# EAGLE schematic Strampler_redesign_v2_2 (EAGLE 7.3.0)
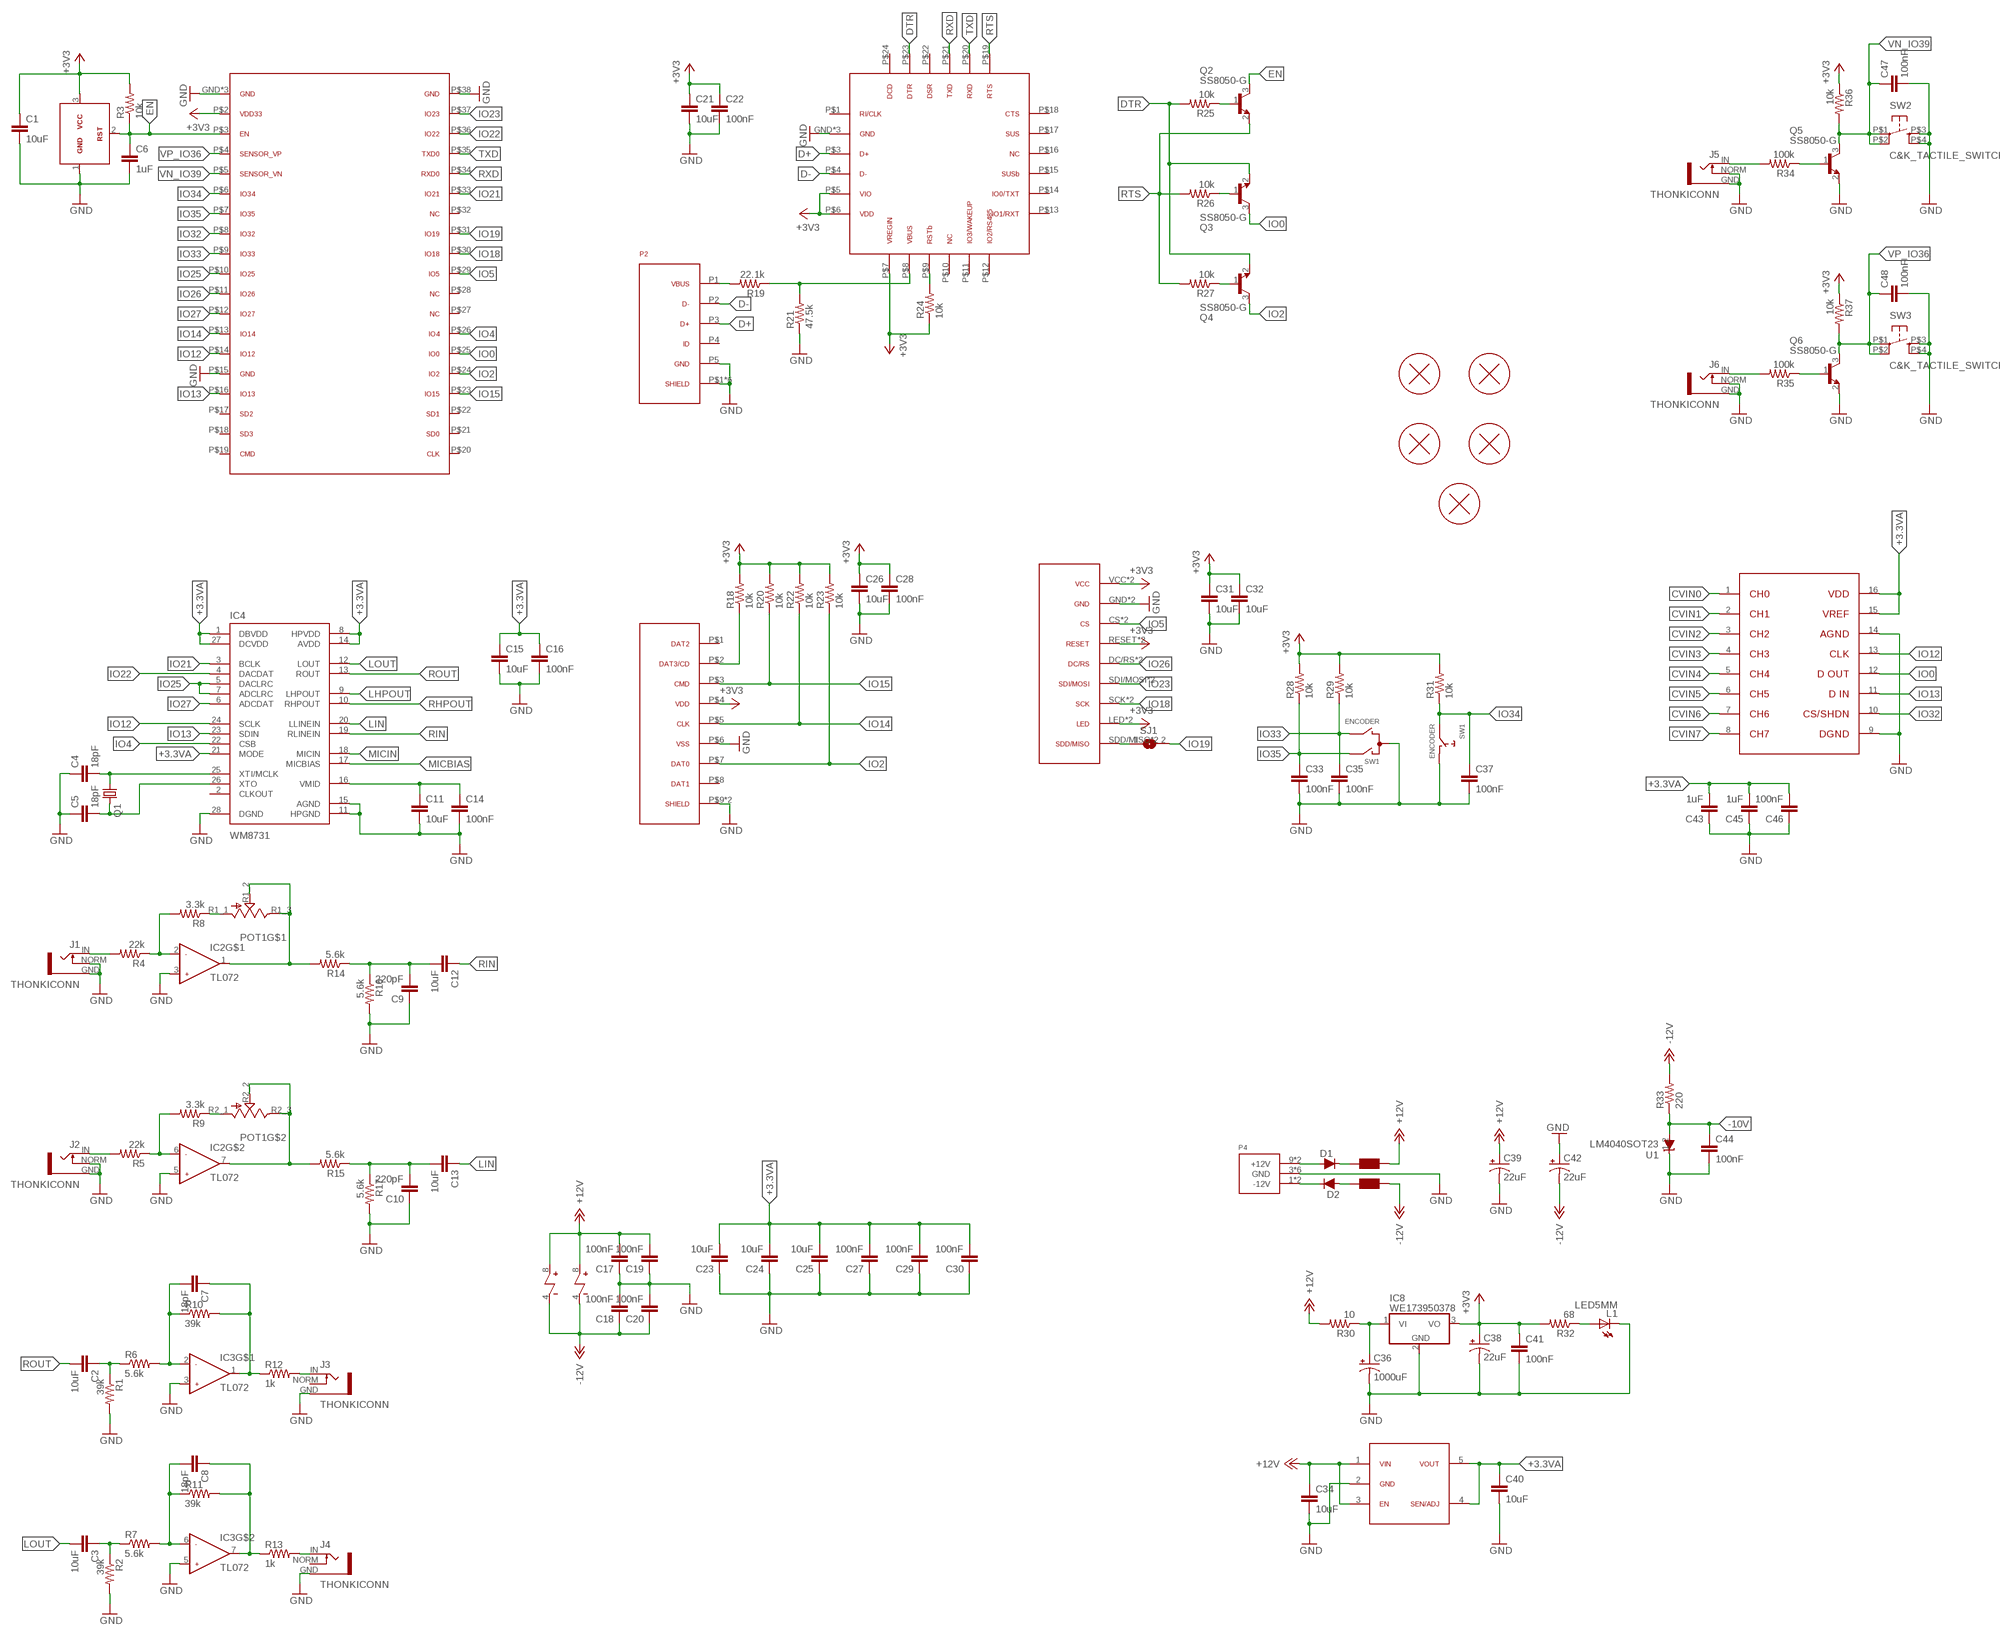
[diagram p0: schematic, sheet 1, part 1 of 2]
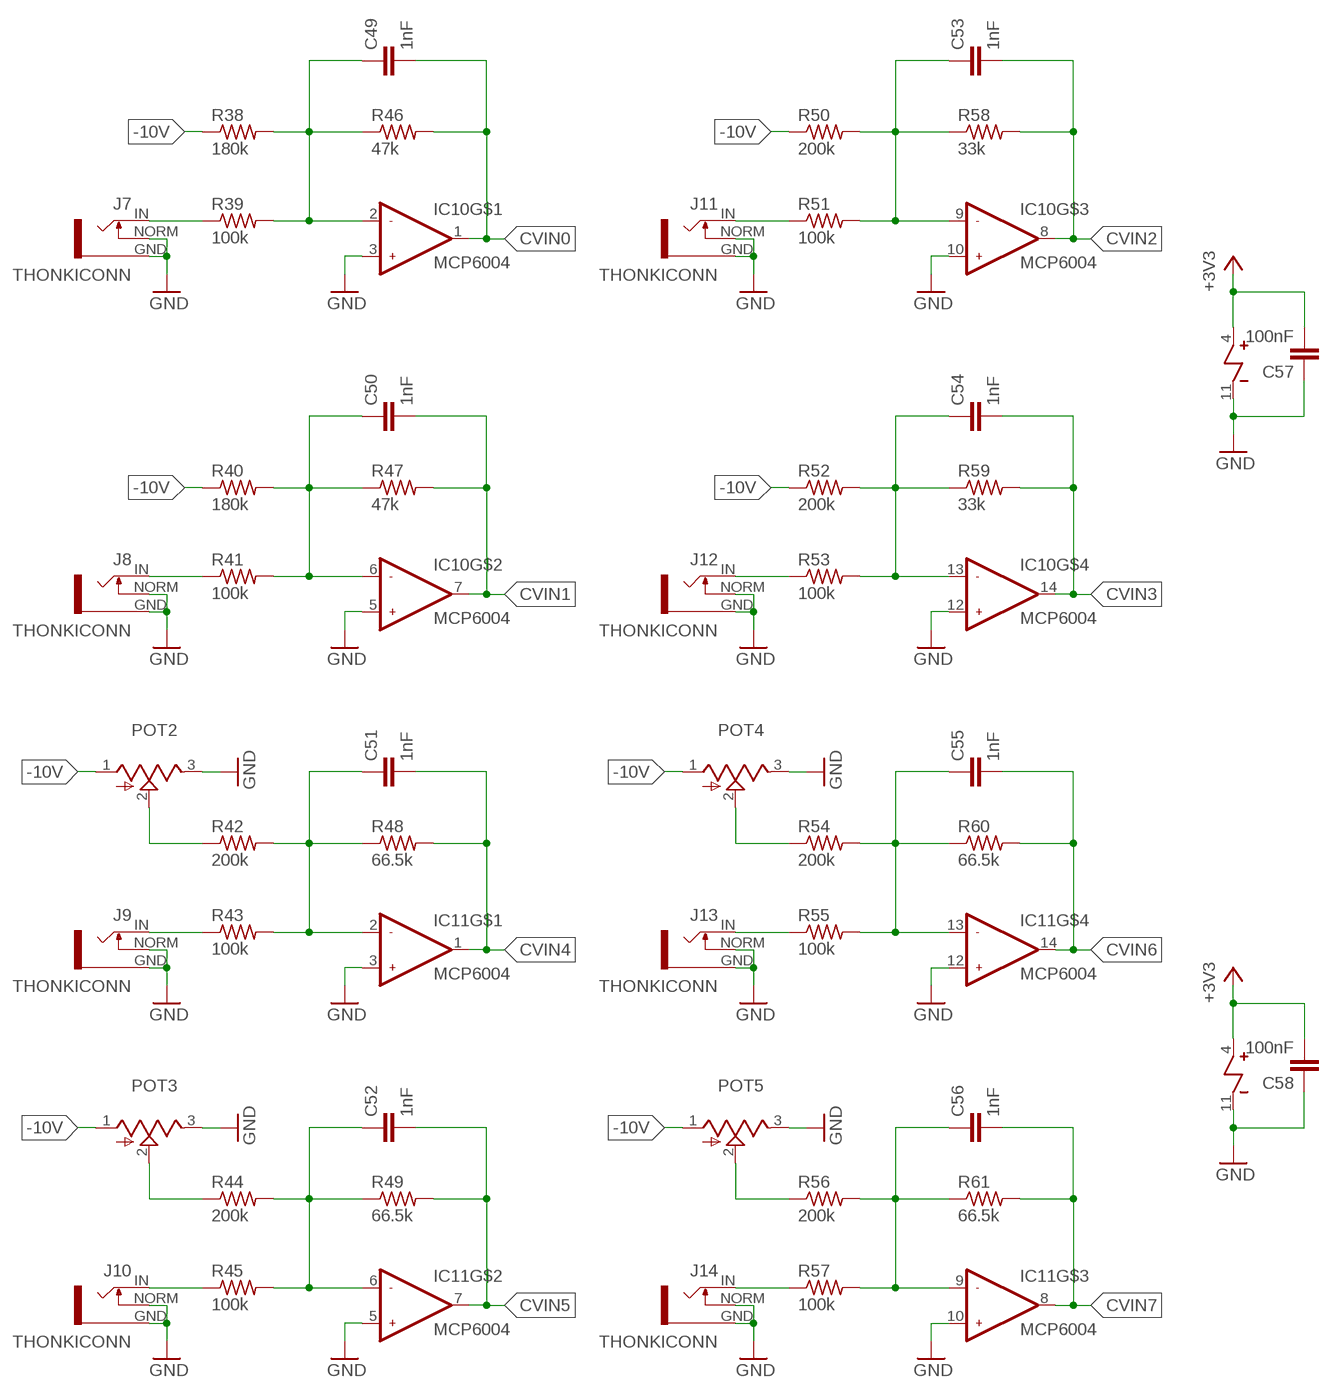
[diagram p1: schematic, sheet 1, part 2 of 2]

## Parts
C1  10uF  CAPACITOR0805  [R0805]
C2  10uF  CAPACITOR0805  [R0805]
C3  10uF  CAPACITOR0805  [R0805]
C4  18pF  CAPACITOR  [RESISTOR_0603]
C5  18pF  CAPACITOR  [RESISTOR_0603]
C6  1uF  CAPACITOR  [RESISTOR_0603]
C7  18pF  CAPACITOR  [RESISTOR_0603]
C8  18pF  CAPACITOR  [RESISTOR_0603]
C9  220pF  CAPACITOR  [RESISTOR_0603]
C10  220pF  CAPACITOR  [RESISTOR_0603]
C11  10uF  CAPACITOR0805  [R0805]
C12  10uF  CAPACITOR0805  [R0805]
C13  10uF  CAPACITOR0805  [R0805]
C14  100nF  CAPACITOR  [RESISTOR_0603]
C15  10uF  CAPACITOR0805  [R0805]
C16  100nF  CAPACITOR  [RESISTOR_0603]
C17  100nF  CAPACITOR  [RESISTOR_0603]
C18  100nF  CAPACITOR  [RESISTOR_0603]
C19  100nF  CAPACITOR  [RESISTOR_0603]
C20  100nF  CAPACITOR  [RESISTOR_0603]
C21  10uF  CAPACITOR0805  [R0805]
C22  100nF  CAPACITOR  [RESISTOR_0603]
C23  10uF  CAPACITOR0805  [R0805]
C24  10uF  CAPACITOR0805  [R0805]
C25  10uF  CAPACITOR0805  [R0805]
C26  10uF  CAPACITOR0805  [R0805]
C27  100nF  CAPACITOR  [RESISTOR_0603]
C28  100nF  CAPACITOR  [RESISTOR_0603]
C29  100nF  CAPACITOR  [RESISTOR_0603]
C30  100nF  CAPACITOR  [RESISTOR_0603]
C31  10uF  CAPACITOR0805  [R0805]
C32  10uF  CAPACITOR0805  [R0805]
C33  100nF  CAPACITOR  [RESISTOR_0603]
C34  10uF  CAPACITOR1210  [R1210]
C35  100nF  CAPACITOR  [RESISTOR_0603]
C36  1000uF  CAP_POLG  [PANASONIC_G]
C37  100nF  CAPACITOR  [RESISTOR_0603]
C38  22uF  CAP_POL1206_TANT  [1206_POL]
C39  22uF  CAP_POL1206_TANT  [1206_POL]
C40  10uF  CAPACITOR0805  [R0805]
C41  100nF  CAPACITOR  [RESISTOR_0603]
C42  22uF  CAP_POL1206_TANT  [1206_POL]
C43  1uF  CAPACITOR  [RESISTOR_0603]
C44  100nF  CAPACITOR  [RESISTOR_0603]
C45  1uF  CAPACITOR  [RESISTOR_0603]
C46  100nF  CAPACITOR  [RESISTOR_0603]
C47  100nF  CAPACITOR  [RESISTOR_0603]
C48  100nF  CAPACITOR  [RESISTOR_0603]
C49  1nF  CAPACITOR  [RESISTOR_0603]
C50  1nF  CAPACITOR  [RESISTOR_0603]
C51  1nF  CAPACITOR  [RESISTOR_0603]
C52  1nF  CAPACITOR  [RESISTOR_0603]
C53  1nF  CAPACITOR  [RESISTOR_0603]
C54  1nF  CAPACITOR  [RESISTOR_0603]
C55  1nF  CAPACITOR  [RESISTOR_0603]
C56  1nF  CAPACITOR  [RESISTOR_0603]
C57  100nF  CAPACITOR  [RESISTOR_0603]
C58  100nF  CAPACITOR  [RESISTOR_0603]
D1  DIODE  [SOD123]
D2  DIODE  [SOD123]
F1  FERRITE-BEAD0805  [R0805]
F2  FERRITE-BEAD0805  [R0805]
H1  PCB_SCREW  [PCB_SCREW]
H2  PCB_SCREW  [PCB_SCREW]
H3  PCB_SCREW  [PCB_SCREW]
H4  PCB_SCREW  [PCB_SCREW]
H5  PCB_SCREW  [PCB_SCREW]
IC1  MIC803  [SOT23]
IC2  TL072  OPAMP_DUAL  [SOIC8]
IC3  TL072  OPAMP_DUAL  [SOIC8]
IC4  WM8731  [SSOP28]
IC5  ESP32-WROVER-B  [ESP32-WROVER-B]
IC6  CP2102N  [CP2102N]
IC7  ADP7118  [SOT23-5L]
IC8  WE173950378  [WE78]
IC9  MCP3208  [SOIC16]
IC10  MCP6004  OPAMP_QUADPWR  [TSSOP14]
IC11  MCP6004  OPAMP_QUADPWR  [TSSOP14]
J1  THONKICONN  [PROTOJACK]
J2  THONKICONN  [PROTOJACK]
J3  THONKICONN  [PROTOJACK]
J4  THONKICONN  [PROTOJACK]
J5  THONKICONN  [PROTOJACK]
J6  THONKICONN  [PROTOJACK]
J7  THONKICONN  [PROTOJACK]
J8  THONKICONN  [PROTOJACK]
J9  THONKICONN  [PROTOJACK]
J10  THONKICONN  [PROTOJACK]
J11  THONKICONN  [PROTOJACK]
J12  THONKICONN  [PROTOJACK]
J13  THONKICONN  [PROTOJACK]
J14  THONKICONN  [PROTOJACK]
L1  LED5MM  [LED_5MM]
P1  SD-CARD  [SD-CARD-THONK]
P2  USB-B  [USB-B-MOLEX-1050170001]
P3  MSP2202_DISPLAY  [MSP2202_DISPLAY]
P4  POWER_SIMPLE10  [POWER_10]
POT1  POT_DUAL_THONK  [POT_DUAL_THONK]
POT2  POT_VERTICAL  [ALPS_POT_VERTICAL]
POT3  POT_VERTICAL  [ALPS_POT_VERTICAL]
POT4  POT_VERTICAL  [ALPS_POT_VERTICAL]
POT5  POT_VERTICAL  [ALPS_POT_VERTICAL]
Q1  CRYSTAL  [HC49UP]
Q2  SS8050-G  MMBT3904SOT23  [SOT23]
Q3  SS8050-G  MMBT3904SOT23  [SOT23]
Q4  SS8050-G  MMBT3904SOT23  [SOT23]
Q5  SS8050-G  MMBT3904SOT23  [SOT23]
Q6  SS8050-G  MMBT3904SOT23  [SOT23]
R1  39k  RESISTOR  [RESISTOR_0603]
R2  39k  RESISTOR  [RESISTOR_0603]
R3  10k  RESISTOR  [RESISTOR_0603]
R4  22k  RESISTOR  [RESISTOR_0603]
R5  22k  RESISTOR  [RESISTOR_0603]
R6  5.6k  RESISTOR  [RESISTOR_0603]
R7  5.6k  RESISTOR  [RESISTOR_0603]
R8  3.3k  RESISTOR  [RESISTOR_0603]
R9  3.3k  RESISTOR  [RESISTOR_0603]
R10  39k  RESISTOR  [RESISTOR_0603]
R11  39k  RESISTOR  [RESISTOR_0603]
R12  1k  RESISTOR  [RESISTOR_0603]
R13  1k  RESISTOR  [RESISTOR_0603]
R14  5.6k  RESISTOR  [RESISTOR_0603]
R15  5.6k  RESISTOR  [RESISTOR_0603]
R16  5.6k  RESISTOR  [RESISTOR_0603]
R17  5.6k  RESISTOR  [RESISTOR_0603]
R18  10k  RESISTOR  [RESISTOR_0603]
R19  22.1k  RESISTOR  [RESISTOR_0603]
R20  10k  RESISTOR  [RESISTOR_0603]
R21  47.5k  RESISTOR  [RESISTOR_0603]
R22  10k  RESISTOR  [RESISTOR_0603]
R23  10k  RESISTOR  [RESISTOR_0603]
R24  10k  RESISTOR  [RESISTOR_0603]
R25  10k  RESISTOR  [RESISTOR_0603]
R26  10k  RESISTOR  [RESISTOR_0603]
R27  10k  RESISTOR  [RESISTOR_0603]
R28  10k  RESISTOR  [RESISTOR_0603]
R29  10k  RESISTOR  [RESISTOR_0603]
R30  10  RESISTOR2512  [R2512]
R31  10k  RESISTOR  [RESISTOR_0603]
R32  68  RESISTOR  [RESISTOR_0603]
R33  220  RESISTOR  [RESISTOR_0603]
R34  100k  RESISTOR  [RESISTOR_0603]
R35  100k  RESISTOR  [RESISTOR_0603]
R36  10k  RESISTOR  [RESISTOR_0603]
R37  10k  RESISTOR  [RESISTOR_0603]
R38  180k  RESISTOR  [RESISTOR_0603]
R39  100k  RESISTOR  [RESISTOR_0603]
R40  180k  RESISTOR  [RESISTOR_0603]
R41  100k  RESISTOR  [RESISTOR_0603]
R42  200k  RESISTOR  [RESISTOR_0603]
R43  100k  RESISTOR  [RESISTOR_0603]
R44  200k  RESISTOR  [RESISTOR_0603]
R45  100k  RESISTOR  [RESISTOR_0603]
R46  47k  RESISTOR  [RESISTOR_0603]
R47  47k  RESISTOR  [RESISTOR_0603]
R48  66.5k  RESISTOR  [RESISTOR_0603]
R49  66.5k  RESISTOR  [RESISTOR_0603]
R50  200k  RESISTOR  [RESISTOR_0603]
R51  100k  RESISTOR  [RESISTOR_0603]
R52  200k  RESISTOR  [RESISTOR_0603]
R53  100k  RESISTOR  [RESISTOR_0603]
R54  200k  RESISTOR  [RESISTOR_0603]
R55  100k  RESISTOR  [RESISTOR_0603]
R56  200k  RESISTOR  [RESISTOR_0603]
R57  100k  RESISTOR  [RESISTOR_0603]
R58  33k  RESISTOR  [RESISTOR_0603]
R59  33k  RESISTOR  [RESISTOR_0603]
R60  66.5k  RESISTOR  [RESISTOR_0603]
R61  66.5k  RESISTOR  [RESISTOR_0603]
SJ1  SJ  [SJ]
SW1  ENCODER  [ALPS_EC12E_SW]
SW2  C&K_TACTILE_SWITCH  [C&K_TACTILE_SWITCH]
SW3  C&K_TACTILE_SWITCH  [C&K_TACTILE_SWITCH]
U1  LM4040SOT23  [SOT23]

## Nets
+3.3VA: C15.1 C16.1 C23.2 C24.2 C25.2 C27.2 C29.2 C30.2 C40.1 C43.2 C45.2 C46.2 IC4.1(DBVDD) IC4.8(HPVDD) IC4.14(AVDD) IC4.21(MODE) IC4.27(DCVDD) IC7.4 IC7.5 IC9.15 IC9.16
+3V3: C1.1 C21.1 C22.1 C26.1 C28.1 C31.1 C32.1 C38.2(+) C41.1 C57.2 C58.2 IC1.3 IC5.P$2 IC6.P$5 IC6.P$6 IC6.P$7 IC8.3(VO) IC10.4 IC11.4 P1.P$4 P3.LED P3.LED1 P3.RESET P3.RESET1 P3.VCC P3.VCC1 R3.2 R18.2 R20.2 R22.2 R23.2 R24.1 R28.2 R29.2 R31.2 R32.2 R36.1 R37.1
+12V: C17.2 C19.2 C34.1 C39.2(+) F1.1 IC2.8 IC3.8 IC7.1 IC7.3 R30.2
-10V: C44.1 POT2.1(A) POT3.1(A) POT4.1(A) POT5.1(A) R33.1 R38.1 R40.1 R50.1 R52.1 U1.2(A)
-12V: C18.1 C20.1 C42.1(-) F2.1 IC2.4 IC3.4 R33.2
CVIN0: C49.2 IC9.1 IC10.1 R46.2
CVIN1: C50.2 IC9.2 IC10.7 R47.2
CVIN2: C53.2 IC9.3 IC10.8 R58.2
CVIN3: C54.2 IC9.4 IC10.14 R59.2
CVIN4: C51.2 IC9.5 IC11.1 R48.2
CVIN5: C52.2 IC9.6 IC11.7 R49.2
CVIN6: C55.2 IC9.7 IC11.14 R60.2
CVIN7: C56.2 IC9.8 IC11.8 R61.2
D+: IC6.P$3 P2.P3
D-: IC6.P$4 P2.P2
DTR: IC6.P$23 Q3.2(E) Q4.2(E) R25.2
EN: C6.1 IC1.2 IC5.P$3 Q2.3(C) R3.1
GND: C1.2 C4.1 C5.1 C6.2 C9.1 C10.1 C11.2 C14.2 C15.2 C16.2 C17.1 C18.2 C19.1 C20.2 C21.2 C22.2 C23.1 C24.1 C25.1 C26.2 C27.1 C28.2 C29.1 C30.1 C31.2 C32.2 C33.2 C34.2 C35.2 C36.- C37.2 C38.1(-) C39.1(-) C40.2 C41.2 C42.2(+) C43.1 C44.2 C45.1 C46.1 C47.2 C48.2 C57.1 C58.1 IC1.1 IC2.3 IC2.5 IC3.3 IC3.5 IC4.11(HPGND) IC4.15(AGND) IC4.28(DGND) IC5.GND IC5.GND2 IC5.P$1 IC5.P$15 IC5.P$38 IC6.GND IC6.GND2 IC6.P$2 IC7.2 IC8.2(GND) IC9.9 IC9.14 IC10.3 IC10.5 IC10.10 IC10.11 IC10.12 IC11.3 IC11.5 IC11.10 IC11.11 IC11.12 J1.GND J1.NORM J2.GND J2.NORM J3.GND J4.GND J5.GND J5.NORM J6.GND J6.NORM J7.GND J7.NORM J8.GND J8.NORM J9.GND J9.NORM J10.GND J10.NORM J11.GND J11.NORM J12.GND J12.NORM J13.GND J13.NORM J14.GND J14.NORM L1.K(C) P1.P$6 P1.P$9 P1.P$10 P2.P5 P2.P$1 P2.P$2 P2.P$8 P2.P$9 P2.P$10 P2.P$11 P3.GND P3.GND1 P4.3(GND) P4.4(GND) P4.5(GND) P4.6(GND) P4.7(GND) P4.8(GND) POT2.3(B) POT3.3(B) POT4.3(B) POT5.3(B) Q5.2(E) Q6.2(E) R1.2 R2.2 R16.2 R17.2 R21.1 SW1.C SW1.D SW2.P$3 SW2.P$4 SW3.P$3 SW3.P$4 U1.1(C)
IO0: IC5.P$25 IC9.12 Q3.3(C)
IO2: IC5.P$24 P1.P$7 Q4.3(C) R23.1
IO4: IC4.22(CSB) IC5.P$26
IO5: IC5.P$29 P3.CS P3.CS1
IO12: IC4.24(SCLK) IC5.P$14 IC9.13
IO13: IC4.23(SDIN) IC5.P$16 IC9.11
IO14: IC5.P$13 P1.P$5 R22.1
IO15: IC5.P$23 P1.P$3 R20.1
IO18: IC5.P$30 P3.SCK P3.SCK1
IO19: IC5.P$31 SJ1.2
IO21: IC4.3(BCLK) IC5.P$33
IO22: IC4.4(DACDAT) IC5.P$36
IO23: IC5.P$37 P3.SDI/MOSI P3.SDI/MOSI1
IO25: IC4.5(DACLRC) IC4.7(ADCLRC) IC5.P$10
IO26: IC5.P$11 P3.DC/RS P3.DC/RS1
IO27: IC4.6(ADCDAT) IC5.P$12
IO32: IC5.P$8 IC9.10
IO33: C35.1 IC5.P$9 R29.1 SW1.B
IO34: C37.1 IC5.P$6 R31.1 SW1.E
IO35: C33.1 IC5.P$7 R28.1 SW1.A
LHPOUT: IC4.9(LHPOUT)
LIN: C13.1 IC4.20(LLINEIN)
LOUT: C3.2 IC4.12(LOUT)
MICBIAS: IC4.17(MICBIAS)
MICIN: IC4.18(MICIN)
N$1: IC6.P$9 R24.2
N$2: IC6.P$8 R19.1 R21.2
N$3: Q2.1(B) R25.1
N$4: P2.P1 R19.2
N$5: P1.P$2 R18.1
N$6: Q3.1(B) R26.1
N$7: P3.SDD/MISO P3.SDD/MISO1 SJ1.1
N$8: J5.IN R34.2
N$9: Q4.1(B) R27.1
N$10: J6.IN R35.2
N$11: Q5.1(B) R34.1
N$12: Q6.1(B) R35.1
N$13: J7.IN R39.1
N$14: J11.IN R51.1
N$15: C53.1 IC10.9 R50.2 R51.2 R58.1
N$16: J8.IN R41.1
N$17: C49.1 IC10.2 R38.2 R39.2 R46.1
N$18: POT3.2(W) R44.1
N$19: C50.1 IC10.6 R40.2 R41.2 R47.1
N$20: J12.IN R53.1
N$21: C54.1 IC10.13 R52.2 R53.2 R59.1
N$22: POT2.2(W) R42.1
N$23: J9.IN R43.1
N$24: C51.1 IC11.2 R42.2 R43.2 R48.1
N$25: J13.IN R55.1
N$26: C55.1 IC11.13 R54.2 R55.2 R60.1
N$27: J10.IN R45.1
N$28: C52.1 IC11.6 R44.2 R45.2 R49.1
N$29: J14.IN R57.1
N$30: C56.1 IC11.9 R56.2 R57.2 R61.1
N$31: J1.IN R4.2
N$32: IC2.2 R4.1 R8.2
N$33: D1.+ P4.9(+12V) P4.10(+12V)
N$34: POT1.R1_1(A) R8.1
N$35: POT5.2(W) R56.1
N$36: IC2.1 POT1.R1_2(W) POT1.R1_3(B) R14.2
N$37: C9.2 C12.2 R14.1 R16.1
N$38: POT4.2(W) R54.1
N$39: J2.IN R5.2
N$40: IC2.6 R5.1 R9.2
N$41: POT1.R2_1(A) R9.1
N$42: IC2.7 POT1.R2_2(W) POT1.R2_3(B) R15.2
N$43: C5.2 IC4.26(XTO) Q1.2
N$44: C4.2 IC4.25(XTI/MCLK) Q1.1
N$45: C10.2 C13.2 R15.1 R17.1
N$46: C7.1 IC3.1 R10.2 R12.1
N$47: D1.- F1.2
N$48: C7.2 IC3.2 R6.2 R10.1
N$49: C2.1 R1.1 R6.1
N$50: C36.+ IC8.1(VI) R30.1
N$52: J3.IN R12.2
N$53: D2.- P4.1(-12V) P4.2(-12V)
N$54: C8.1 IC3.7 R11.2 R13.1
N$55: C8.2 IC3.6 R7.2 R11.1
N$56: C11.1 C14.1 IC4.16(VMID)
N$57: C3.1 R2.1 R7.1
N$58: J4.IN R13.2
N$59: D2.+ F2.2
N$60: L1.A R32.1
RHPOUT: IC4.10(RHPOUT)
RIN: C12.1 IC4.19(RLINEIN)
ROUT: C2.2 IC4.13(ROUT)
RTS: IC6.P$19 Q2.2(E) R26.2 R27.2
RXD: IC5.P$34 IC6.P$21
TXD: IC5.P$35 IC6.P$20
VN_IO39: C47.1 IC5.P$5 Q5.3(C) R36.2 SW2.P$1 SW2.P$2
VP_IO36: C48.1 IC5.P$4 Q6.3(C) R37.2 SW3.P$1 SW3.P$2
Unconnected: IC4.2(CLKOUT) IC5.P$17 IC5.P$18 IC5.P$19 IC5.P$20 IC5.P$21 IC5.P$22 IC5.P$27 IC5.P$28 IC5.P$32 IC6.P$1 IC6.P$10 IC6.P$11 IC6.P$12 IC6.P$13 IC6.P$14 IC6.P$15 IC6.P$16 IC6.P$17 IC6.P$18 IC6.P$22 IC6.P$24 J3.NORM J4.NORM P1.P$1 P1.P$8 P2.P4 SW1.GND1(G) SW1.GND2(G)

## Library data of the parts
C1-C35 C37 C40 C41 C43-C58 = parts_aman:CAPACITOR
C36 C38 C39 C42 = parts_aman:CAP_POL
D1 D2 = parts_aman:DIODE
F1 F2 = parts_aman:FERRITE-BEAD
H1-H5 = parts_aman:PCB_SCREW
IC1 = parts_aman:MIC803
IC2 IC3 = parts_aman:OPAMP_DUAL
IC4 = og-dac:WM8731
IC5 = parts_aman:ESP32-WROVER-B
IC6 = parts_aman:CP2102N
IC7 = parts_aman:ADP7118
IC8 = parts_aman:WE173950378
IC9 = parts_aman:MCP3208
IC10 IC11 = parts_aman:OPAMP_QUAD
J1-J14 = parts_aman:THONKICONN
L1 = parts_aman:LED
P1 = parts_aman:SD-CARD
P2 = parts_aman:USB-B
P3 = parts_aman:MSP2202_DISPLAY
P4 = parts_aman:POWER_SIMPLE
POT1 = parts_aman:POT_DUAL_THONK
POT2-POT5 = parts_aman:POT_VERTICAL
Q1 = parts_aman:CRYSTAL
Q2-Q6 = parts_aman:MMBT3904
R1-R61 = parts_aman:RESISTOR
SJ1 = parts_aman:SJ: SMD solder JUMPER
SW1 = parts_aman:ENCODER: ALPS rotary Encoder EC12E series with switch; MPN: EC12E2424407; OC_FARNELL: 1520813; OC_NEWARK: 74M1068
SW2 SW3 = parts_aman:C&K_TACTILE_SWITCH
U1 = parts_aman:LM4040